# EAGLE design Conductivity probe (EAGLE 7.6.0)
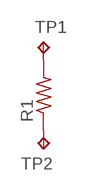
[diagram p0: schematic, sheet 1]

## Parts
R1  R-US_0204/7  [0204/7]
TP1  TPPAD1-17  [P1-17]
TP2  TPPAD1-17  [P1-17]

## Nets
N$2: R1.2 TP1.TP
N$3: R1.1 TP2.TP

## Library data of the parts
R1 = resistor:R-US_: RESISTOR, American symbol
TP1 TP2 = testpad:TP: Test pad

## Board
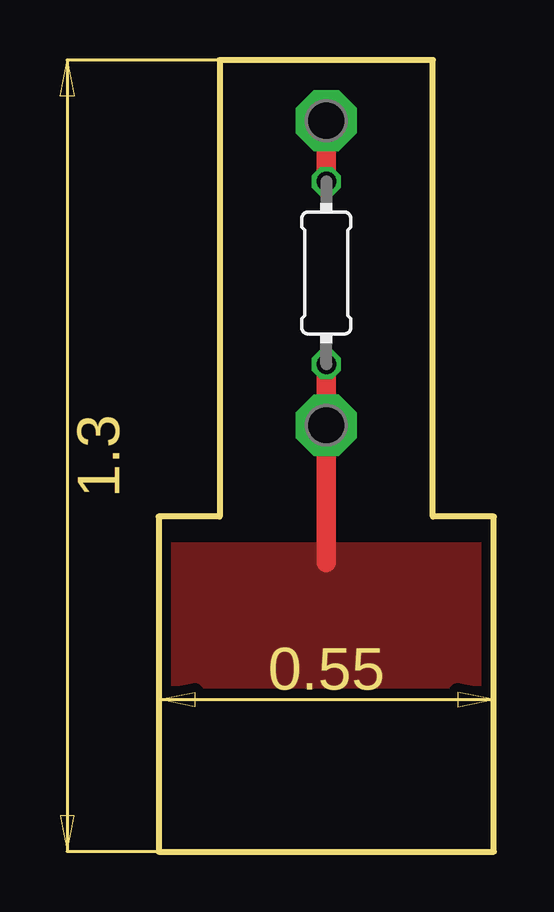
[diagram p1: board, top side]

Size 13.97 x 33.01 mm. Coordinates in mm from the lower left corner, seen from the top.
Outline: 0,0 13.97,0 13.97,13.97 11.43,13.97 11.43,33.01 2.54,33.01 2.54,13.97 0,13.97 0,0
Copper layers (1*16): Top 0.0356mm / dielectric 1.5011mm / Bottom 0.0356mm
Design rules "Oshpark": minimum track width 6mil, minimum drill 13mil, track to track 6mil, track to pad 6mil, pad to pad 6mil, via to via 6mil, smd to smd 6mil, copper to edge 15mil, drill to drill 6mil, minimum pad ring 7mil, minimum via ring 7mil, stop-mask expansion 3mil, vias tented up to drill 0mil, thermal gap 10mil

### Footprints (pad centres in the part's own frame; a part is rotated, then mirrored left to right if it is on the bottom)
0204/7 = drill 0.813 octagon: 1 -3.81,0; 2 3.81,0
P1-17 = drill 1.702 pad 2.54 octagon: TP 0,0

### Placement (x,y rotation side)
R1  6.99,24.13 90 top
TP1  6.99,30.48 0 top
TP2  6.99,17.78 0 top

### Tracks (layer width: path | path; a pad name or v marks a point on that pad's centre or on a via)
N$2
  Top 0.813: TP1.TP R1.2
N$3
  Top 0.813: R1.1 TP2.TP 6.99,12.06
  pour Top: 0,0 0,12.7 13.97,12.7 13.97,0